# Altium schematic sheet MCU_Ver1.SchDoc
size A3; SheetNumber: 1; SheetTotal: 1
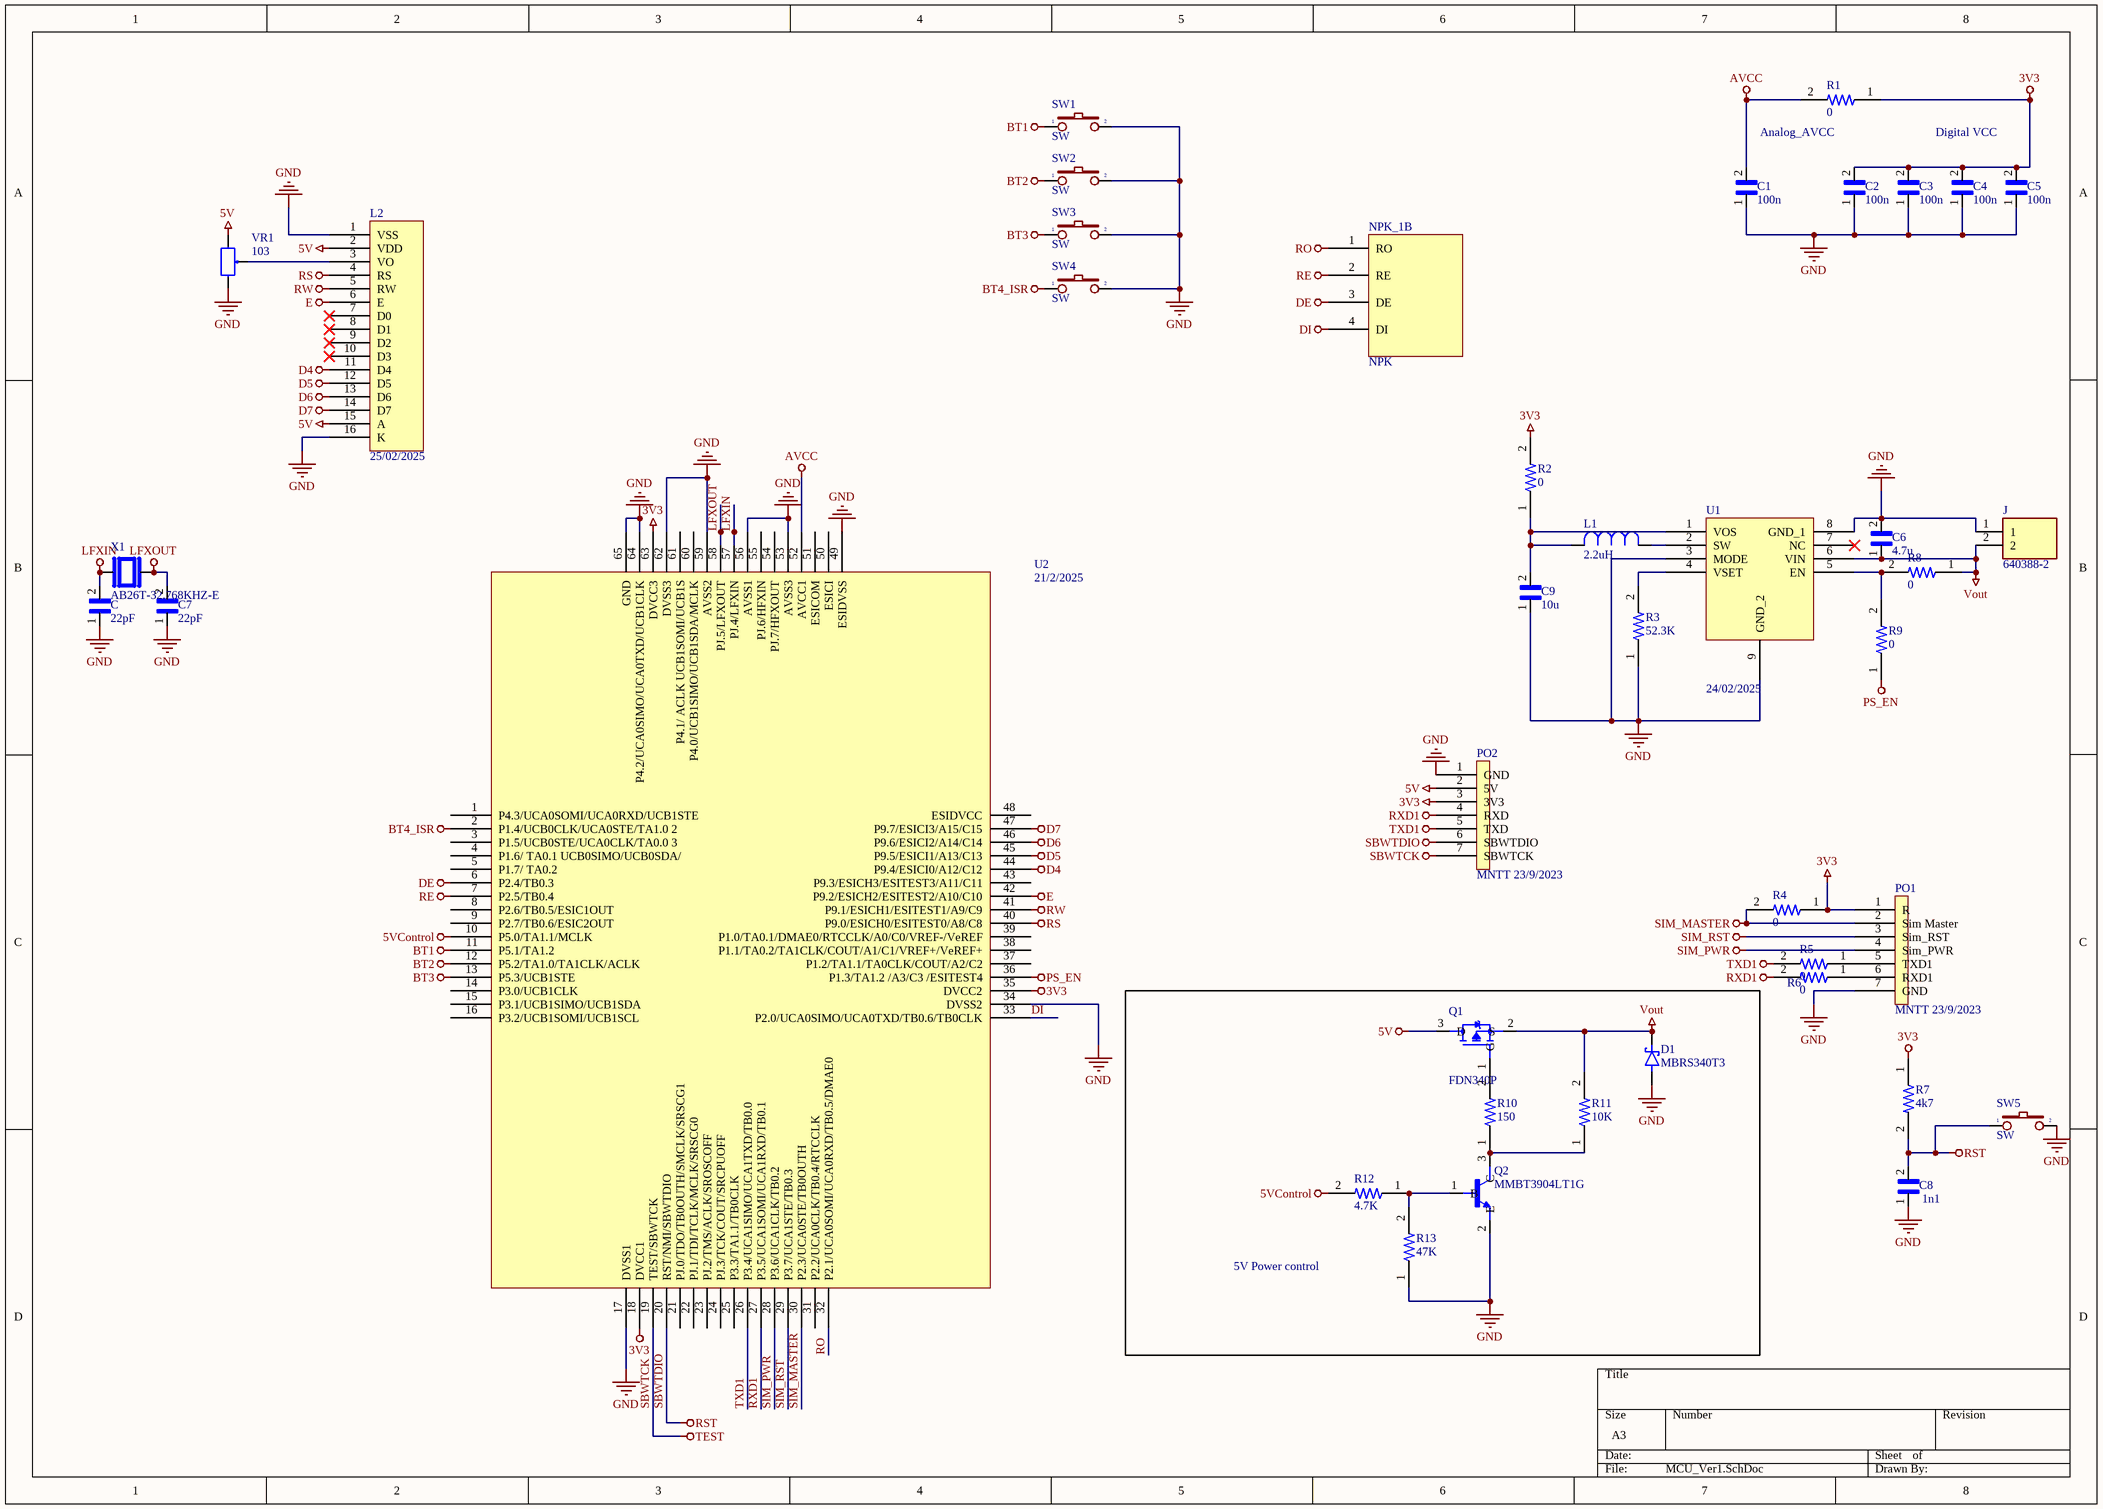
[diagram p0: MCU_Ver1.SchDoc]

## Parts
C  22pF  [CAPC0603X33N]
C1  100n  [CAPC0603X33N]
C2  100n  [CAPC0603X33N]
C3  100n  [CAPC0603X33N]
C4  100n  [CAPC0603X33N]
C5  100n  [CAPC0603X33N]
C6  4.7u  [CAPC0603X33N]
C7  22pF  [CAPC0603X33N]
C8  1n1  [CAPC0603X33N]
C9  10u  [CAPC0603X33N]
D1  MBRS340T3  [DIOM7959X261N]
J  640388-2  [TE_640388-2]
L1  2.2uH  [IND_CDRH127/LDNP-470MC_SUM]
L2  25/02/2025  [PCBComponent_1]
NPK_1  NPK  [PCBComponent_1]  (part B of 2)
PO1  MNTT 23/9/2023  [PCBComponent_1]
PO2  MNTT 23/9/2023  [PCBComponent_1]
Q1  FDN340P  [SOT95P240X120-3N]
Q2  MMBT3904LT1G  [SOT95P240X111-3N]
R1  0  [RESC1608X50N]
R2  0  [RESC1608X50N]
R3  52.3K  [RESC1608X50N]
R4  0  [RESC1608X50N]
R5  0  [RESC1608X50N]
R6  0  [RESC1608X50N]
R7  4k7  [RESC1608X50N]
R8  0  [RESC1608X50N]
R9  0  [RESC1608X50N]
R10  150  [CAPC0603X33N]
R11  10K  [CAPC0603X33N]
R12  4.7K  [CAPC0603X33N]
R13  47K  [CAPC0603X33N]
SW1  SW  [SW2]
SW2  SW  [SW2]
SW3  SW  [SW2]
SW4  SW  [SW2]
SW5  SW  [SW2]
U1  24/02/2025  [SOP65P490X110-9N]
U2  21/2/2025  [IC_BQ500215RGCR]
VR1  103  [VR]
X1  AB26T-32.768KHZ-E  [XTAL_AB26T-32.768KHZ-E]

## Blocks framed on the sheet
5V Power control: D1 Q1 Q2 R10-R13

## Nets
3V3: C2.2 C3.2 C4.2 C5.2 PO1.1(R) PO2.3(3V3) R1.1 R2.2 R4.1 R7.1 U2.18(DVCC1) U2.35(DVCC2) U2.63(DVCC3)
5V: L2.2(VDD) L2.15(A) PO2.2(5V) Q1.3(D) VR1.1
5VControl: R12.2 U2.10(P5.0/TA1.1/MCLK)
AVCC: C1.2 R1.2 U2.52(AVCC1)
BT1: SW1.1 U2.11(P5.1/TA1.2)
BT2: SW2.1 U2.12(P5.2/TA1.0/TA1CLK/ACLK)
BT3: SW3.1 U2.13(P5.3/UCB1STE)
BT4_ISR: SW4.1 U2.2(P1.4/UCB0CLK/UCA0STE/TA1.0_2)
D4: L2.11(D4) U2.44(P9.4/ESICI0/A12/C12)
D5: L2.12(D5) U2.45(P9.5/ESICI1/A13/C13)
D6: L2.13(D6) U2.46(P9.6/ESICI2/A14/C14)
D7: L2.14(D7) U2.47(P9.7/ESICI3/A15/C15)
DE: NPK_1.3(DE) U2.6(P2.4/TB0.3)
DI: NPK_1.4(DI) U2.33(P2.0/UCA0SIMO/UCA0TXD/TB0.6/TB0CLK)
E: L2.6(E) U2.42(P9.2/ESICH2/ESITEST2/A10/C10)
GND: C.1 C1.1 C2.1 C3.1 C4.1 C5.1 C6.2 C7.1 C8.1 C9.1 D1.A J.1 L2.1(VSS) L2.16(K) PO1.7(GND) PO2.1(GND) Q2.2(E) R3.1 R13.1 SW1.2 SW2.2 SW3.2 SW4.2 SW5.2 U1.3(MODE) U1.8(GND_1) U1.9(GND_2) U2.17(DVSS1) U2.34(DVSS2) U2.49(ESIDVSS) U2.53(AVSS3) U2.56(AVSS1) U2.59(AVSS2) U2.62(DVSS3) U2.64(P4.2/UCA0SIMO/UCA0TXD/UCB1CLK) U2.65(GND) VR1.3
LFXIN: C.2 U2.57(PJ.4/LFXIN) X1.1
LFXOUT: C7.2 U2.58(PJ.5/LFXOUT) X1.2
PS_EN: R9.1 U2.36(P1.3/TA1.2_/A3/C3_/ESITEST4)
RE: NPK_1.2(RE) U2.7(P2.5/TB0.4)
RO: NPK_1.1(RO) U2.32(P2.1/UCA0SOMI/UCA0RXD/TB0.5/DMAE0)
RS: L2.4(RS) U2.40(P9.0/ESICH0/ESITEST0/A8/C8)
RW: L2.5(RW) U2.41(P9.1/ESICH1/ESITEST1/A9/C9)
RXD1: PO2.4(RXD) R6.2 U2.27(P3.5/UCA1SOMI/UCA1RXD/TB0.1)
SBWTCK: PO2.7(SBWTCK) U2.19(TEST/SBWTCK)  [also labelled TEST]
SBWTDIO: C8.2 PO2.6(SBWTDIO) R7.2 SW5.1 U2.20(RST/NMI/SBWTDIO)  [also labelled RST]
SIM_MASTER: PO1.2(Sim_Master) R4.2 U2.30(P2.3/UCA0STE/TB0OUTH)
SIM_PWR: PO1.4(Sim_PWR) U2.28(P3.6/UCA1CLK/TB0.2)
SIM_RST: PO1.3(Sim_RST) U2.29(P3.7/UCA1STE/TB0.3)
TXD1: PO2.5(TXD) R5.2 U2.26(P3.4/UCA1SIMO/UCA1TXD/TB0.0)
Vout: C6.1 D1.C(K) J.2 Q1.2(S) R8.1 R11.2 U1.6(VIN)
NetC9_2: C9.2 L1.2 R2.1 U1.1(VOS)
NetL1_1: L1.1 U1.2(SW)
NetL2_3: L2.3(VO) VR1.2
NetPO1_5: PO1.5(TXD1) R5.1
NetPO1_6: PO1.6(RXD1) R6.1
NetQ1_1: Q1.1(G) R10.2
NetQ2_1: Q2.1(B) R12.1 R13.2
NetQ2_3: Q2.3(C) R10.1 R11.1
NetR3_2: R3.2 U1.4(VSET)
NetR8_2: R8.2 R9.2 U1.5(EN)

Not connected (* = marked no-connect by the designer): L2 7(D0)* 8(D1)* 9(D2)* 10(D3)*; U1 7(NC)*; U2 1(P4.3/UCA0SOMI/UCA0RXD/UCB1STE_) 3(P1.5/UCB0STE/UCA0CLK/TA0.0_3) 4(P1.6/_TA0.1_UCB0SIMO/UCB0SDA/_) 5(P1.7/_TA0.2) 8(P2.6/TB0.5/ESIC1OUT) 9(P2.7/TB0.6/ESIC2OUT) 14(P3.0/UCB1CLK) 15(P3.1/UCB1SIMO/UCB1SDA) 16(P3.2/UCB1SOMI/UCB1SCL) 21(PJ.0/TDO/TB0OUTH/SMCLK/SRSCG1) 22(PJ.1/TDI/TCLK/MCLK/SRSCG0) 23(PJ.2/TMS/ACLK/SROSCOFF) 24(PJ.3/TCK/COUT/SRCPUOFF) 25(P3.3/TA1.1/TB0CLK) 31(P2.2/UCA0CLK/TB0.4/RTCCLK) 37(P1.2/TA1.1/TA0CLK/COUT/A2/C2) 38(_P1.1/TA0.2/TA1CLK/COUT/A1/C1/VREF+/VeREF+) 39(P1.0/TA0.1/DMAE0/RTCCLK/A0/C0/VREF-/VeREF) 43(_P9.3/ESICH3/ESITEST3/A11/C11) 48(ESIDVCC) 50(ESICI) 51(ESICOM) 54(PJ.7/HFXOUT) 55(PJ.6/HFXIN) 60(P4.0/UCB1SIMO/UCB1SDA/MCLK) 61(P4.1/_ACLK_UCB1SOMI/UCB1S)

## Notes on the sheet
- Analog_AVCC
- Digital VCC

## Library data of the parts
C C1-C9 = GRM033R71H102KA12D: SMD Capacitor X7R_EIA_ with Capacitance: 1000pF Tol. 10%. Rated Voltage: 50Vdc; MF: Murata; Digi-Key_Part_Number: 490-10682-1-ND; MP: GRM033R71H102KA12D; SnapEDA_Link: https://www.snapeda.com/parts/GRM033R71H102KA12D/Murata/view-part/4374985/?ref=snap; Value: *; Package: 0603 Taiyo Yuden; Digi-Key_Purchase_URL: https://www.digikey.com/product-detail/en/murata-electronics/GRM033R71H102KA12D/490-10682-1-ND/5251423?utm_source=snapeda&utm_medium=aggregator&utm_campaign=symbol
D1 = MBRS340T3: Diode Schottky 40V 4A Surface Mount SMC; MF: ON Semiconductor; SnapEDA_Link: https://www.snapeda.com/parts/MBRS340T3/Onsemi/view-part/?ref=snap; Package: SMC-2 ON Semiconductor; Value: *; MP: MBRS340T3; Check_prices: https://www.snapeda.com/parts/MBRS340T3/Onsemi/view-part/?ref=eda
J = 640388-2: Header; Conn; Interconnect System; PCB Plug; 2 Cont; Solder; MTA-156 Series; Straight; MF: TE Connectivity; MP: 640388-2; Value: *; TE_purchase_URL: https://www.te.com/usa-en/product-640388-2.html?te_bu=Cor&te_type=disp&te_campaign=seda_glo_cor-seda-global-disp-prtnr-fy19-seda-model-bom-cta_sma-317_1&elqCampaignId=32493; SnapEDA_Link: https://www.snapeda.com/parts/640388-2/TE%20Connectivity%20AMP%20Connectors/view-part/437691/?ref=snap; Price: None; EU_RoHS_Compliance: Compliant; Package: None; Availability: Unavailable
L1 = CDRH127/LDNP-470MC: 47 ÂµH Shielded - Inductor 3.25 A 78mOhm Max Nonstandard; MF: Sumida America; SnapEDA_Link: https://www.snapeda.com/parts/CDRH127/LDNP-470MC/Sumida+America+Components+Inc./view-part/?ref=snap; MP: CDRH127/LDNP-470MC; Availability: In Stock; Price: None; Value: *; Check_prices: https://www.snapeda.com/parts/CDRH127/LDNP-470MC/Sumida+America+Components+Inc./view-part/?ref=eda; Package: Nonstandard Sumida; Purchase-URL: https://pricing.snapeda.com/search/part/CDRH127/LDNP-470MC/?ref=eda
L2 = LCD1602
NPK_1 = NPK: 02/04/2024. NPK_?
PO1 PO2 = Port 7 pins
Q1 = FDN340P: FDN340P Series 20V 70 mOhm Single P-Ch Logic Level PowerTrench Mosfet SSOT-3; Price: None; MP: FDN340P; Availability: Unavailable; Value: *; Package: None
Q2 = MMBT3904LT1G: Bipolar _BJT_ Transistor NPN 40V 200mA 300MHz 300mW Surface Mount SOT-23-3 _TO-236_; MF: ON Semiconductor; Value: *; Package: SOT-23-3 NXP Semiconductors; SnapEDA_Link: https://www.snapeda.com/parts/MMBT3904LT1G/ON%20Semiconductor/view-part/587490/?ref=snap; Price: None; Availability: Unavailable; MP: MMBT3904LT1G
R1-R13 = CRGS0603J180K: RES SMD 180K OHM 5% 1/4W 0603; Package: None; Price: None; Value: *; MP: CRGS0603J180K; Availability: Unavailable
SW1-SW5 = SW2: Switch button 2 pin; Value: SW chip 2 pin
U1 = TPS62842DGRR
U2 = MSP430FR5989_VER2
VR1 = VR: Var Resistor; Value: VR 10K
X1 = AB26T-32.768KHZ-E: 32.768kHz WATCH CRYSTAL, 6.2 x 02.1MM CYLINDER PACKAGE; MF: Abracon LLC; SnapEDA_Link: https://www.snapeda.com/parts/AB26T-32.768KHZ-E/Abracon/view-part/?ref=snap; Package: Radial Abracon LLC; Value: *; MP: AB26T-32.768KHZ-E; Check_prices: https://www.snapeda.com/parts/AB26T-32.768KHZ-E/Abracon/view-part/?ref=eda